# Altium schematic sheet URESP_AFE_1.SchDoc
size A4
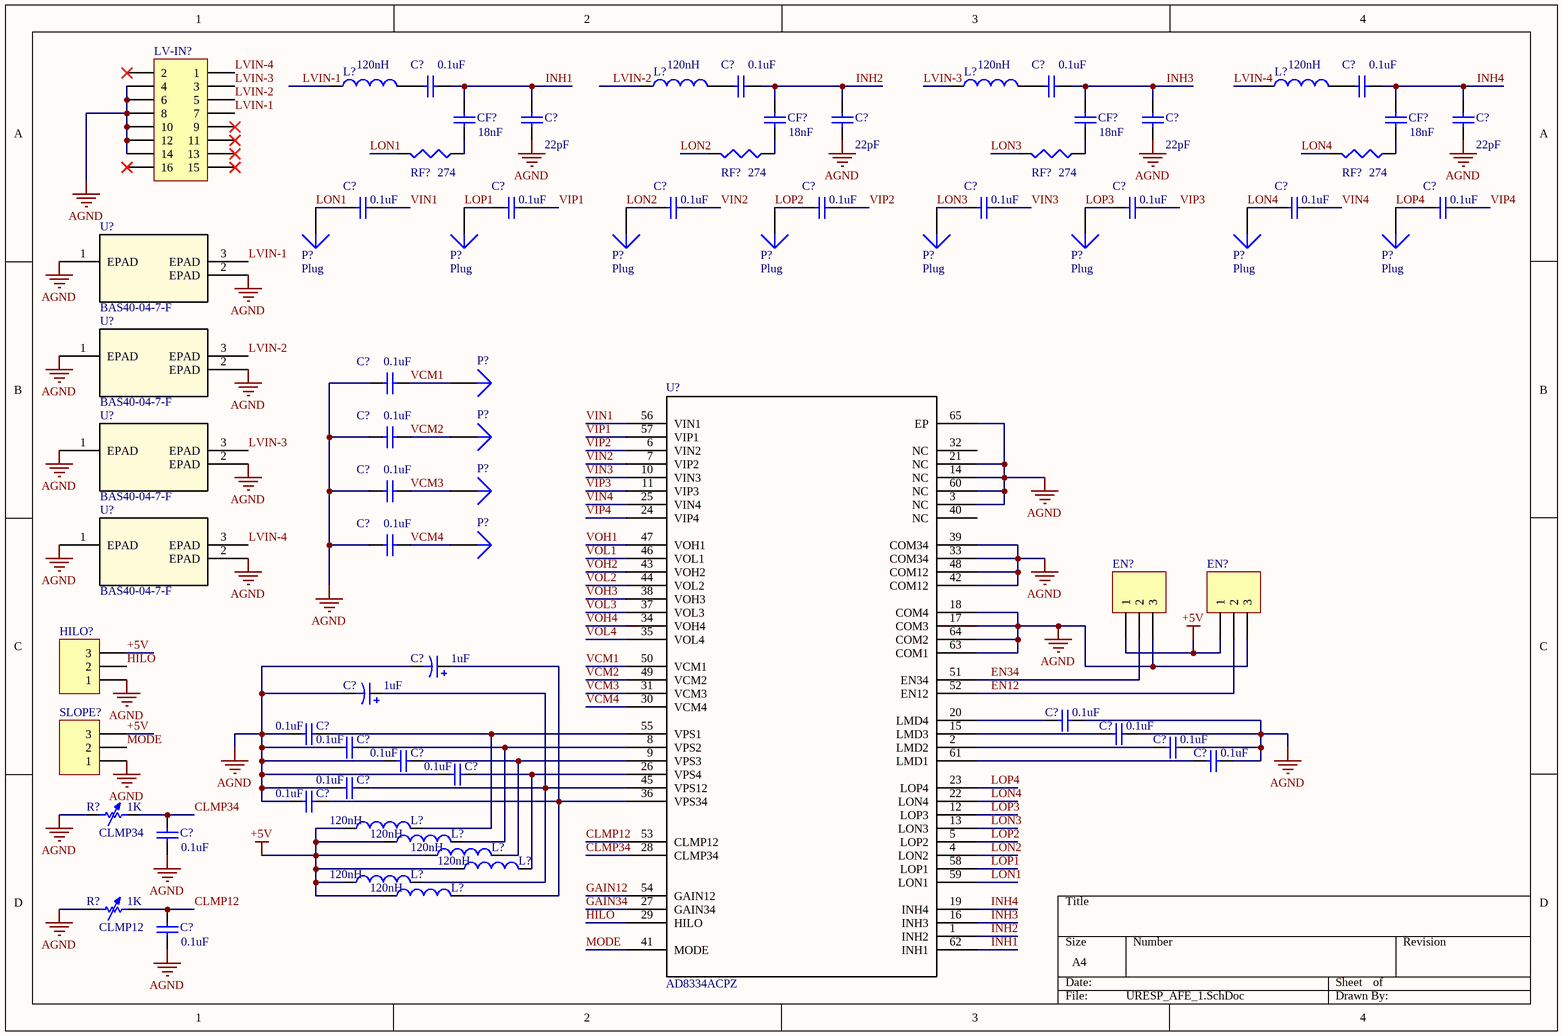
[diagram p0: URESP_AFE_1.SchDoc]

## Parts
(Parts that share a designator on the sheet are numbered #1, #2 ... from top to bottom, then left to right.)
C?#1  value 0.1uF  [1608[0603]]
C?#2  value 0.1uF  [1608[0603]]
C?#3  value 0.1uF  [1608[0603]]
C?#4  value 0.1uF  [1608[0603]]
C?#5  value 22pF  [1608[0603]]
C?#6  value 22pF  [1608[0603]]
C?#7  value 22pF  [1608[0603]]
C?#8  value 22pF  [1608[0603]]
C?#9  value 0.1uF  [1608[0603]]
C?#10  value 0.1uF  [1608[0603]]
C?#11  value 0.1uF  [1608[0603]]
C?#12  value 0.1uF  [1608[0603]]
C?#13  value 0.1uF  [1608[0603]]
C?#14  value 0.1uF  [1608[0603]]
C?#15  value 0.1uF  [1608[0603]]
C?#16  value 0.1uF  [1608[0603]]
C?#17  value 0.1uF  [1608[0603]]
C?#18  value 0.1uF  [1608[0603]]
C?#19  value 0.1uF  [1608[0603]]
C?#20  value 0.1uF  [1608[0603]]
C?#21  value 1uF  [C0805]
C?#22  value 1uF  [C0805]
C?#23  value 0.1uF  [1608[0603]]
C?#24  value 0.1uF  [1608[0603]]
C?#25  value 0.1uF  [1608[0603]]
C?#26  value 0.1uF  [1608[0603]]
C?#27  value 0.1uF  [1608[0603]]
C?#28  value 0.1uF  [1608[0603]]
C?#29  value 0.1uF  [1608[0603]]
C?#30  value 0.1uF  [1608[0603]]
C?#31  value 0.1uF  [1608[0603]]
C?#32  value 0.1uF  [1608[0603]]
C?#33  value 0.1uF  [1608[0603]]
C?#34  value 0.1uF  [1608[0603]]
CF?#1  value 18nF  [1608[0603]]
CF?#2  value 18nF  [1608[0603]]
CF?#3  value 18nF  [1608[0603]]
CF?#4  value 18nF  [1608[0603]]
EN?#1  (no value)  [HDR1X3]
EN?#2  (no value)  [HDR1X3]
HILO?  (no value)  [HDR1X3]
L?#1  value 120nH  [INDC1608L]
L?#2  value 120nH  [INDC1608L]
L?#3  value 120nH  [INDC1608L]
L?#4  value 120nH  [INDC1608L]
L?#5  value 120nH  [INDC1608L]
L?#6  value 120nH  [INDC1608L]
L?#7  value 120nH  [INDC1608L]
L?#8  value 120nH  [INDC1608L]
L?#9  value 120nH  [INDC1608L]
L?#10  value 120nH  [INDC1608L]
LV-IN?  (no value)  [HDR2X8]
P?#1  Plug  [PIN1]
P?#2  Plug  [PIN1]
P?#3  Plug  [PIN1]
P?#4  Plug  [PIN1]
P?#5  Plug  [PIN1]
P?#6  Plug  [PIN1]
P?#7  Plug  [PIN1]
P?#8  Plug  [PIN1]
P?#9  (no value)  [PIN1]
P?#10  (no value)  [PIN1]
P?#11  (no value)  [PIN1]
P?#12  (no value)  [PIN1]
R?#1  CLMP34  value 1K  [RES1206R]
R?#2  CLMP12  value 1K  [RES1206R]
RF?#1  value 274  [J1-0603]
RF?#2  value 274  [J1-0603]
RF?#3  value 274  [J1-0603]
RF?#4  value 274  [J1-0603]
SLOPE?  (no value)  [HDR1X3]
U?#1  BAS40-04-7-F  [SOT-23]
U?#2  BAS40-04-7-F  [SOT-23]
U?#3  AD8334ACPZ  [CP_64_1]
U?#4  BAS40-04-7-F  [SOT-23]
U?#5  BAS40-04-7-F  [SOT-23]

## Nets
+5V: EN?#1.1 EN?#2.1 HILO?.3 L?#5.1 L?#6.1 L?#7.1 L?#8.1 L?#9.1 L?#10.1 SLOPE?.3
AGND: C?#5.1 C?#6.1 C?#7.1 C?#8.1 C?#17.2 C?#18.2 C?#19.2 C?#20.2 C?#21.2 C?#22.2 C?#23.1 C?#24.1 C?#25.1 C?#26.1 C?#27.1 C?#28.1 C?#29.1 C?#30.1 C?#31.1 C?#32.1 C?#33.1 C?#34.1 EN?#1.3 EN?#2.3 HILO?.1 LV-IN?.4 LV-IN?.6 LV-IN?.8 LV-IN?.10 LV-IN?.12 LV-IN?.14 R?#1.1 R?#2.1 SLOPE?.1 U?#1.1(EPAD) U?#1.2(EPAD) U?#2.1(EPAD) U?#2.2(EPAD) U?#3.3(NC) U?#3.14(NC) U?#3.17(COM3) U?#3.18(COM4) U?#3.21(NC) U?#3.33(COM34) U?#3.39(COM34) U?#3.42(COM12) U?#3.48(COM12) U?#3.60(NC) U?#3.63(COM1) U?#3.64(COM2) U?#3.65(EP) U?#4.1(EPAD) U?#4.2(EPAD) U?#5.1(EPAD) U?#5.2(EPAD)
CLMP12: C?#34.2 R?#2.2 U?#3.53(CLMP12)
CLMP34: C?#33.2 R?#1.2 U?#3.28(CLMP34)
EN12: EN?#2.2 U?#3.52(EN12)
EN34: EN?#1.2 U?#3.51(EN34)
GAIN12: U?#3.54(GAIN12)
GAIN34: U?#3.27(GAIN34)
HILO: HILO?.2 U?#3.29(HILO)
INH1: C?#1.2 C?#5.2 CF?#1.2 U?#3.62(INH1)
INH2: C?#2.2 C?#6.2 CF?#2.2 U?#3.1(INH2)
INH3: C?#3.2 C?#7.2 CF?#3.2 U?#3.16(INH3)
INH4: C?#4.2 C?#8.2 CF?#4.2 U?#3.19(INH4)
LON1: C?#9.1 P?#1.1 RF?#1.2 U?#3.59(LON1)
LON2: C?#11.1 P?#3.1 RF?#2.2 U?#3.4(LON2)
LON3: C?#13.1 P?#5.1 RF?#3.2 U?#3.13(LON3)
LON4: C?#15.1 P?#7.1 RF?#4.2 U?#3.22(LON4)
LOP1: C?#10.1 P?#2.1 U?#3.58(LOP1)
LOP2: C?#12.1 P?#4.1 U?#3.5(LOP2)
LOP3: C?#14.1 P?#6.1 U?#3.12(LOP3)
LOP4: C?#16.1 P?#8.1 U?#3.23(LOP4)
LVIN-1: L?#1.1 LV-IN?.7 U?#1.3(EPAD)
LVIN-2: L?#2.1 LV-IN?.5 U?#2.3(EPAD)
LVIN-3: L?#3.1 LV-IN?.3 U?#4.3(EPAD)
LVIN-4: L?#4.1 LV-IN?.1 U?#5.3(EPAD)
MODE: SLOPE?.2 U?#3.41(MODE)
VCM1: C?#17.1 P?#9.1 U?#3.50(VCM1)
VCM2: C?#18.1 P?#10.1 U?#3.49(VCM2)
VCM3: C?#19.1 P?#11.1 U?#3.31(VCM3)
VCM4: C?#20.1 P?#12.1 U?#3.30(VCM4)
VIN1: C?#9.2 U?#3.56(VIN1)
VIN2: C?#11.2 U?#3.7(VIP2)
VIN3: C?#13.2 U?#3.10(VIN3)
VIN4: C?#15.2 U?#3.25(VIN4)
VIP1: C?#10.2 U?#3.57(VIP1)
VIP2: C?#12.2 U?#3.6(VIN2)
VIP3: C?#14.2 U?#3.11(VIP3)
VIP4: C?#16.2 U?#3.24(VIP4)
VOH1: U?#3.47(VOH1)
VOH2: U?#3.43(VOH2)
VOH3: U?#3.38(VOH3)
VOH4: U?#3.34(VOH4)
VOL1: U?#3.46(VOL1)
VOL2: U?#3.44(VOL2)
VOL3: U?#3.37(VOL3)
VOL4: U?#3.35(VOL4)
NetC?#1_1: C?#1.1 L?#1.2
NetC?#2_1: C?#2.1 L?#2.2
NetC?#3_1: C?#3.1 L?#3.2
NetC?#4_1: C?#4.1 L?#4.2
NetC?#21_1: C?#21.1 C?#32.2 L?#10.2 U?#3.36(VPS34)
NetC?#22_1: C?#22.1 C?#30.2 L?#9.2 U?#3.45(VPS12)
NetC?#23_2: C?#23.2 L?#5.2 U?#3.55(VPS1)
NetC?#24_2: C?#24.2 L?#6.2 U?#3.8(VPS2)
NetC?#25_2: C?#25.2 U?#3.20(LMD4)
NetC?#26_2: C?#26.2 L?#7.2 U?#3.9(VPS3)
NetC?#27_2: C?#27.2 U?#3.15(LMD3)
NetC?#28_2: C?#28.2 L?#8.2 U?#3.26(VPS4)
NetC?#29_2: C?#29.2 U?#3.2(LMD2)
NetC?#31_2: C?#31.2 U?#3.61(LMD1)
NetCF?#1_1: CF?#1.1 RF?#1.1
NetCF?#2_1: CF?#2.1 RF?#2.1
NetCF?#3_1: CF?#3.1 RF?#3.1
NetCF?#4_1: CF?#4.1 RF?#4.1

Not connected (* = marked no-connect by the designer): LV-IN? 2* 9* 11* 13* 15* 16*; U?#3 32(NC) 40(NC)

## Library data of the parts
C?#1-C?#20 C?#23-C?#34 CF?#1-CF?#4 = Cap Semi: Capacitor (Semiconductor SIM Model); Published: 8-Jun-2000; LatestRevisionDate: 29-May-2009; LatestRevisionNote: IPC-7351 Footprint Added.; PackageReference: C1206; Publisher: Altium Limited; PackageDescription: Chip Capacitor
C?#21 C?#22 = Cap Pol3: Polarized Capacitor (Surface Mount); Published: 8-Jun-2000; LatestRevisionDate: 29-May-2009; LatestRevisionNote: IPC-7351 Footprint Added.; PackageReference: C0805; Publisher: Altium Limited; PackageDescription: Chip Capacitor
EN?#1 EN?#2 HILO? SLOPE? = Header 3: Header, 3-Pin; LatestRevisionDate: 17-Jul-2002; LatestRevisionNote: Re-released for DXP Platform.; Publisher: Altium Limited
L?#1-L?#10 = Inductor: Code_IEC: 1005; Published: 8-Jun-2000; LatestRevisionDate: 29-May-2009; LatestRevisionNote: IPC-7351 Footprint Added.; PackageReference: 0402-A; Publisher: Altium Limited; PackageDescription: Chip Inductor; Code_JEITA: 0402
LV-IN? = Header 8X2H: Header, 8-Pin, Dual row, Right Angle; LatestRevisionDate: 17-Jul-2002; LatestRevisionNote: Re-released for DXP Platform.; Publisher: Altium Limited
P?#9-P?#12 = Plug: LatestRevisionDate: 17-Jul-2002; LatestRevisionNote: Re-released for DXP Platform.; Publisher: Altium Limited
R?#1 R?#2 = Res Adj1: Variable Resistor; Set Position: 0.5; Published: 8-Jun-2000; LatestRevisionDate: 17-Jul-2002; LatestRevisionNote: Re-released for DXP Platform.; PackageReference: AXIAL-0.7; Publisher: Altium Limited; PackageDescription: Axial Device, Thru-Hole; 2 Leads; 0.7 in Pin Spacing
RF?#1-RF?#4 = Res3: Resistor; Published: 8-Jun-2000; LatestRevisionDate: 29-May-2009; LatestRevisionNote: IPC-7351 Footprint Added.; PackageReference: J1-0603; Publisher: Altium Limited; PackageDescription: Chip Resistor
U?#1 U?#2 U?#4 U?#5 = BAS40-04-7-F: Imported; Vendor: Diodes Inc; Built_By: EMA_UL_Team; Manufacturer_Part_Number: BAS40-04-7-F; Value: Value; Type: Type; RefDes: RefDes
U?#3 = AD8334ACPZ: Imported; RefDes: RefDes; Type: DEV; Value: Value
P?#1-P?#8 = Plug: LatestRevisionDate: 17-Jul-2002; LatestRevisionNote: Re-released for DXP Platform.; Publisher: Altium Limited